# EAGLE design M1n_name (EAGLE 7.7.0)
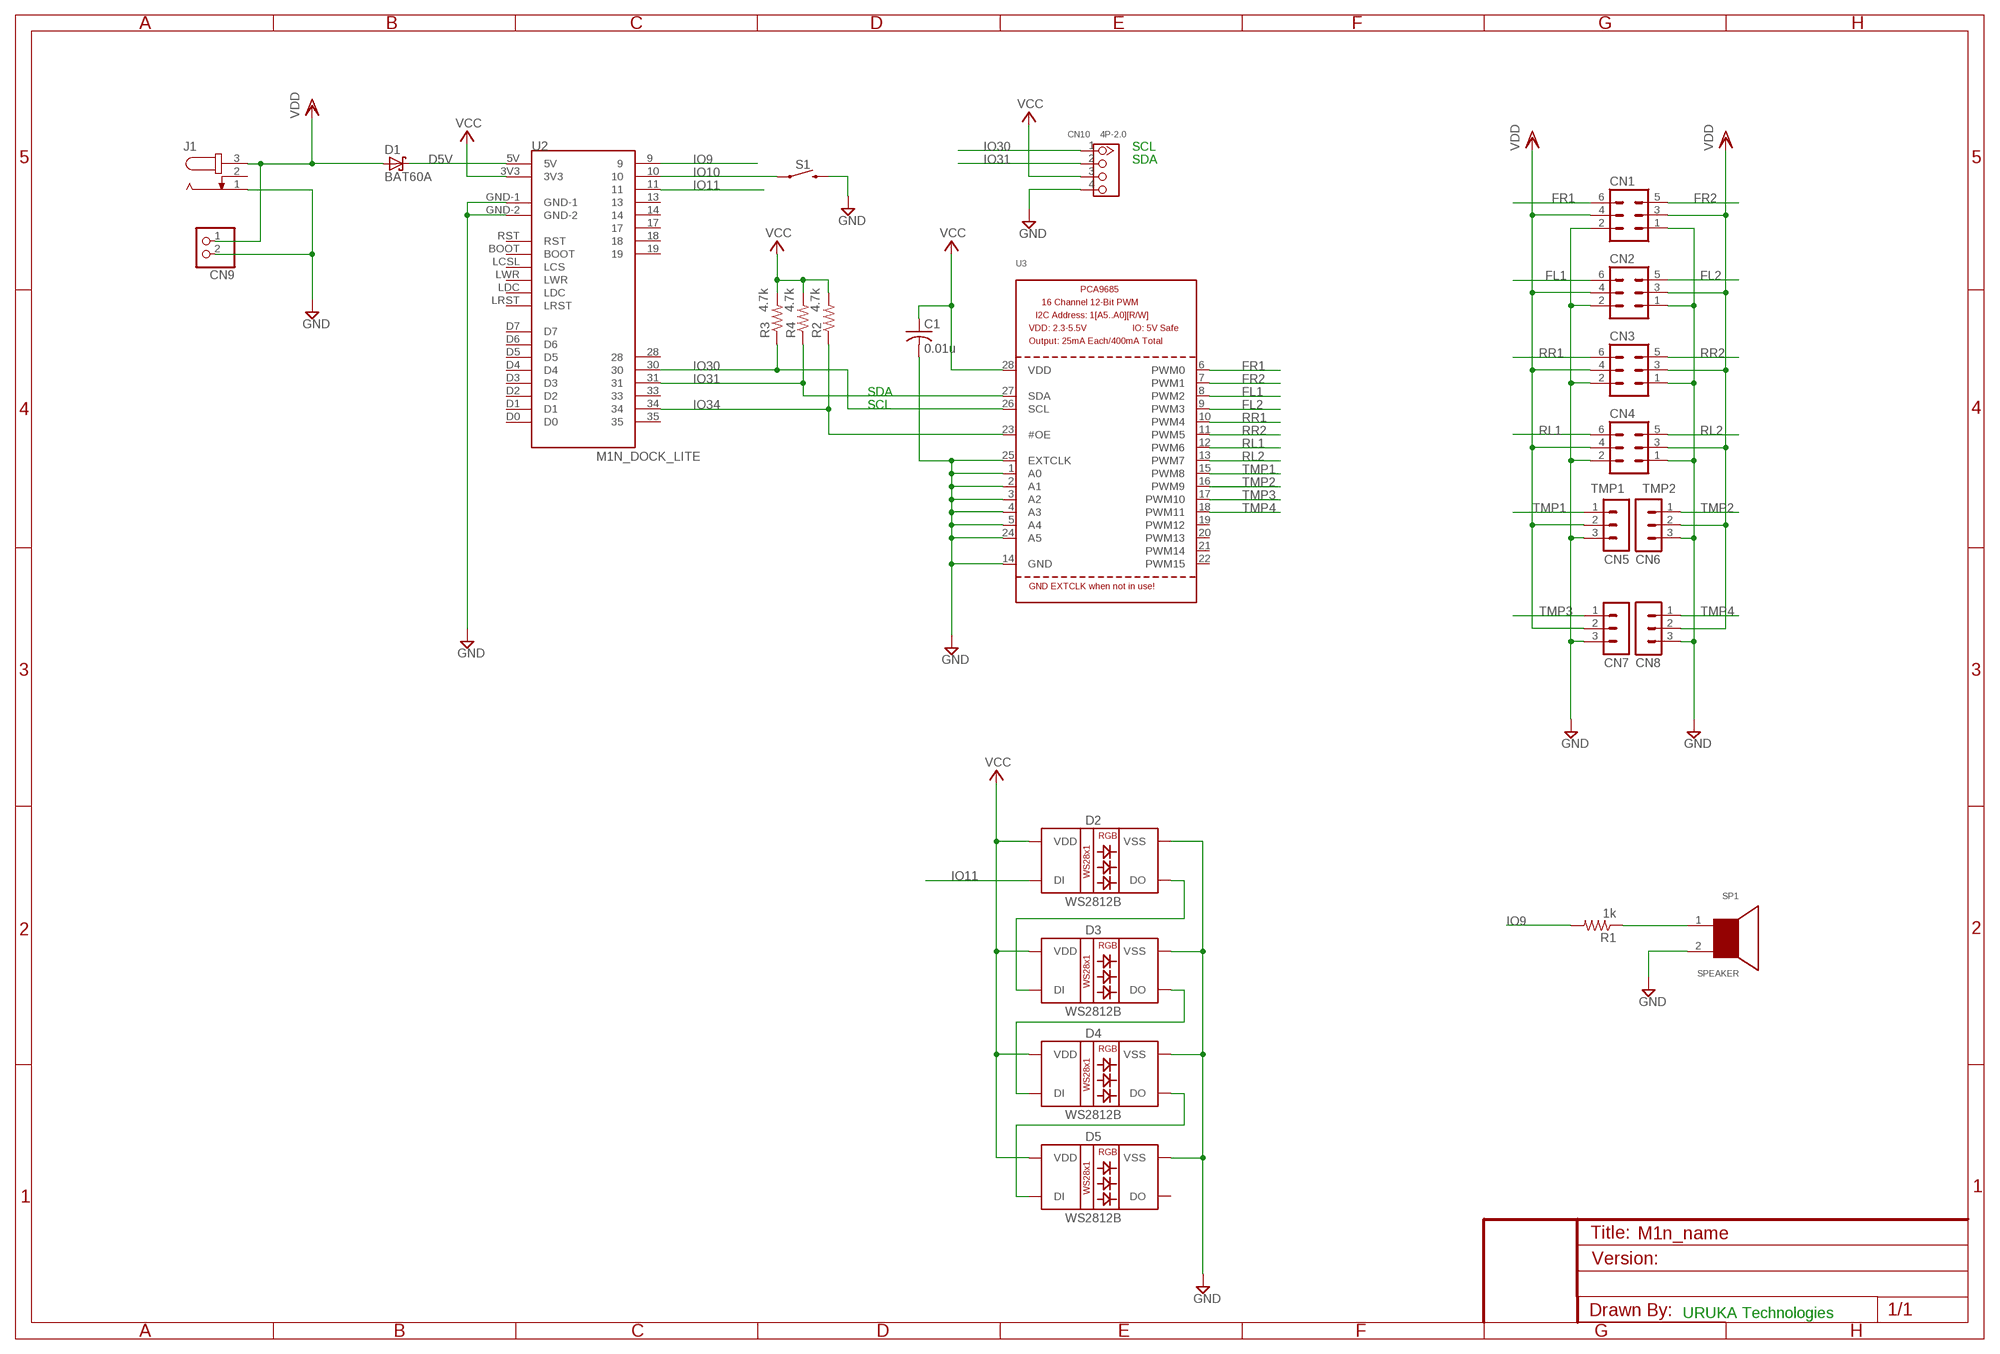
[diagram p0: schematic, sheet 1]

## Parts
C1  0.01u  C-USC0603  [C0603]
CN1  MA03-2  [MA03-2]
CN2  MA03-2  [MA03-2]
CN3  MA03-2  [MA03-2]
CN4  MA03-2  [MA03-2]
CN5  MA03-1  [MA03-1]
CN6  MA03-1  [MA03-1]
CN7  MA03-1  [MA03-1]
CN8  MA03-1  [MA03-1]
CN9  JST_2PIN-THM  [JST-PH-2-THM]
CN10  4P-2.0  GROVE-CONNECTOR-DIP(4P-2.0)  [HW4-2.0]
D1  BAT60A  [SOD323_ST]
D2  WS2812B  WS2812_2020  [WS2812_2020]
D3  WS2812B  WS2812_2020  [WS2812_2020]
D4  WS2812B  WS2812_2020  [WS2812_2020]
D5  WS2812B  WS2812_2020  [WS2812_2020]
J1  JACK-PLUG0  [SPC4077]
R1  1k  R-US_0204/5  [0204/5]
R2  4.7k  R-US_0204/5  [0204/5]
R3  4.7k  R-US_0204/5  [0204/5]
R4  4.7k  R-US_0204/5  [0204/5]
S1  MOMENTARY-SWITCH-SPST-SMD-6.0X3.5MM  [TACTILE_SWITCH_SMD_6.0X3.5MM]
SP1  SPEAKER  [SPEAKER]
U2  M1N_DOCK_LITE  [M1N_DOCK_LITE]
U3  PCA9685  [TSSOP28]

## Nets
D5V [pow]: D1.C U2.5V
FL1: CN2.6 U3.8(PWM2)
FL2: CN2.5 U3.9(PWM3)
FR1: CN1.6 U3.6(PWM0)
FR2: CN1.5 U3.7(PWM1)
GND [pow]: C1.2 CN1.1 CN1.2 CN2.1 CN2.2 CN3.1 CN3.2 CN4.1 CN4.2 CN5.3 CN6.3 CN7.3 CN8.3 CN9.2 CN10.4 D2.2(VSS) D3.2(VSS) D4.2(VSS) D5.2(VSS) J1.1 S1.2 SP1.2 U2.GND-1 U2.GND-2 U3.1(A0) U3.2(A1) U3.3(A2) U3.4(A3) U3.5(A4) U3.14(GND) U3.24(A5) U3.25(EXTCLK)
IO9: R1.2 U2.9
IO10: S1.1 U2.10
IO11: D2.3(DI) U2.11
IO30: CN10.1 R3.1 U2.30 U3.26(SCL)
IO31: CN10.2 R4.1 U2.31 U3.27(SDA)
IO34: R2.1 U2.34 U3.23(#OE)
N$3: D2.1(DO) D3.3(DI)
N$5: D3.1(DO) D4.3(DI)
N$7: D4.1(DO) D5.3(DI)
N$8: R1.1 SP1.1
RL1: CN4.6 U3.12(PWM6)
RL2: CN4.5 U3.13(PWM7)
RR1: CN3.6 U3.10(PWM4)
RR2: CN3.5 U3.11(PWM5)
TMP1: CN5.1 U3.15(PWM8)
TMP2: CN6.1 U3.16(PWM9)
TMP3: CN7.1 U3.17(PWM10)
TMP4: CN8.1 U3.18(PWM11)
VCC [pow]: C1.1 CN10.3 D2.4(VDD) D3.4(VDD) D4.4(VDD) D5.4(VDD) R2.2 R3.2 R4.2 U2.3V3 U3.28(VDD)
VDD [pow]: CN1.3 CN1.4 CN2.3 CN2.4 CN3.3 CN3.4 CN4.3 CN4.4 CN5.2 CN6.2 CN7.2 CN8.2 CN9.1 D1.A J1.3
Unconnected: D5.1(DO) J1.2 U2.13 U2.14 U2.17 U2.18 U2.19 U2.28 U2.33 U2.35 U2.BOOT U2.D0 U2.D1 U2.D2 U2.D3 U2.D4 U2.D5 U2.D6 U2.D7 U2.LCSL(LCS) U2.LDC U2.LRST U2.LWR U2.RST U3.19(PWM12) U3.20(PWM13) U3.21(PWM14) U3.22(PWM15)

## Notes on the sheet
- SCL
- SDA
- SDA
- SCL
- URUKA Technologies

## Library data of the parts
C1 = adafruit:C-US: CAPACITOR, American symbol
CN1-CN4 = suna_lib:MA03-2: PIN HEADER; OC_FARNELL: unknown; OC_NEWARK: unknown
CN5-CN8 = suna_lib:MA03-1: PIN HEADER; OC_FARNELL: unknown; OC_NEWARK: unknown
CN9 = suna_lib:JST_2PIN: JST 2-Pin Connectors of various flavors SMT-RA (S2B-PH-SM4) 4UConnector #17311 SMT (B2B-PH-SM4) THM-RA (S2B-PH) THM (B2B-PH)
CN10 = Seeed-OPL-Connector:GROVE-CONNECTOR-DIP(4P-2.0): 320110033
D1 = suna_lib:BAT60A: Schottky barrier diode Source: www.st.com, BAT60J.pdf
D2-D5 = suna_lib:WS2812_2020: WS2812 2020 SMD addressable RGB LED 2x2mm SMD LED with built-in controller IC.; PROD_ID: DIO-12503
J1 = suna_lib:JACK-PLUG: DC POWER JACK Power Jack, DC, Right Angle, Through Hole, Rated 5A at 16VDC, PC Terminals Distributor: Farnell (www.Farnell.de) Drawing: 84N1161.pdf / 84N1162.pdf Manufacturer: SPC Technology (www.spctechnology.com) Type: SPC4077 / SPC 4078; OC_FARNELL: unknown; OC_NEWARK: unknown
R1-R4 = rcl:R-US_: RESISTOR, American symbol
S1 = SparkFun-Switches:MOMENTARY-SWITCH-SPST: Momentary Switch (Pushbutton) - SPST Normally-open (NO) SPST momentary switches (buttons, pushbuttons). Variants PTH-12MM - 12mm square, through-hole Momentary Pushbutton Switch - 12mm Square <https://www.sparkfun.com/products/9190> (COM-09190) PTH-6.0MM, PTH-6.0MM-KIT - 6.0mm square, through-hole Mini Pushbutton Switch <https://www.sparkfun.com/products/97> (COM-00097) KIT package intended for soldering kit's - only one side of pads' copper is exposed. PTH-RIGHT-ANGLE-KIT - Right-angle, through-hole Right Angle Tactile Button <https://www.sparkfun.com/products/10791> - Used on SparkFun BigTime Watch Kit <https://www.sparkfun.com/products/11734> SMD-12MM - 12mm square, surface-mount Tactile Button - SMD (12mm) <https://www.sparkfun.com/products/12993> (COM-12993) Used on SparkFun PicoBoard <https://www.sparkfun.com/products/11888> SMD-4.5MM - 4.5mm Square Trackball Switch Used on SparkFun Blackberry Trackballer Breakout <https://www.sparkfun.com/products/13169> SMD-4.6MMX2.8MM - 4.60mm x 2.80mm, surface mount Used on SparkFun SAMD21 Mini Breakout <https://www.sparkfun.com/products/13664> SMD-5.2MM, SMD-5.2-REDUNDANT - 5.2mm square, surface-mount Mini Pushbutton Switch - SMD <https://www.sparkfun.com/products/8720> (COM-08720) Used on Arduino Pro Mini <https://www.sparkfun.com/products/11114> REDUNDANT package connects both switch circuits together SMD-6.0X3.5MM - 6.0 x 3.5mm, surface mount Momentary Reset Switch SMD <https://www.sparkfun.com/products/8229> (COM-08229) SMD-6.2MM-TALL - 6.2mm square, surface mount Tactile Button - SMD (6mm) <https://www.sparkfun.com/products/12992> Used on SparkFun Digital Sandbox <https://www.sparkfun.com/products/12651> SMD-RIGHT-ANGLE - Right-angle, surface mount Used on SparkFun Block for Intel® Edison - Arduino <https://www.sparkfun.com/products/13036>; PROD_ID: SWCH-14278; SF_SKU: COM-08229
SP1 = cq:SPEAKER
U2 = suna_lib:M1N_DOCK_LITE
U3 = adafruit:PCA9685: PCA9685 - 16 Channel 12-Bit I2C PWM Controller 5.0V tolerant 16 channel, 12-bit I2C PWM controller with 25mA per output (max. 400mA total) Digikey: 568-5931-1-ND

## Net classes
1 pow: width 0.61 mm
2 GND: width 0.61 mm
3 moter: width 0.762 mm, clearance 0.254 mm

## Board
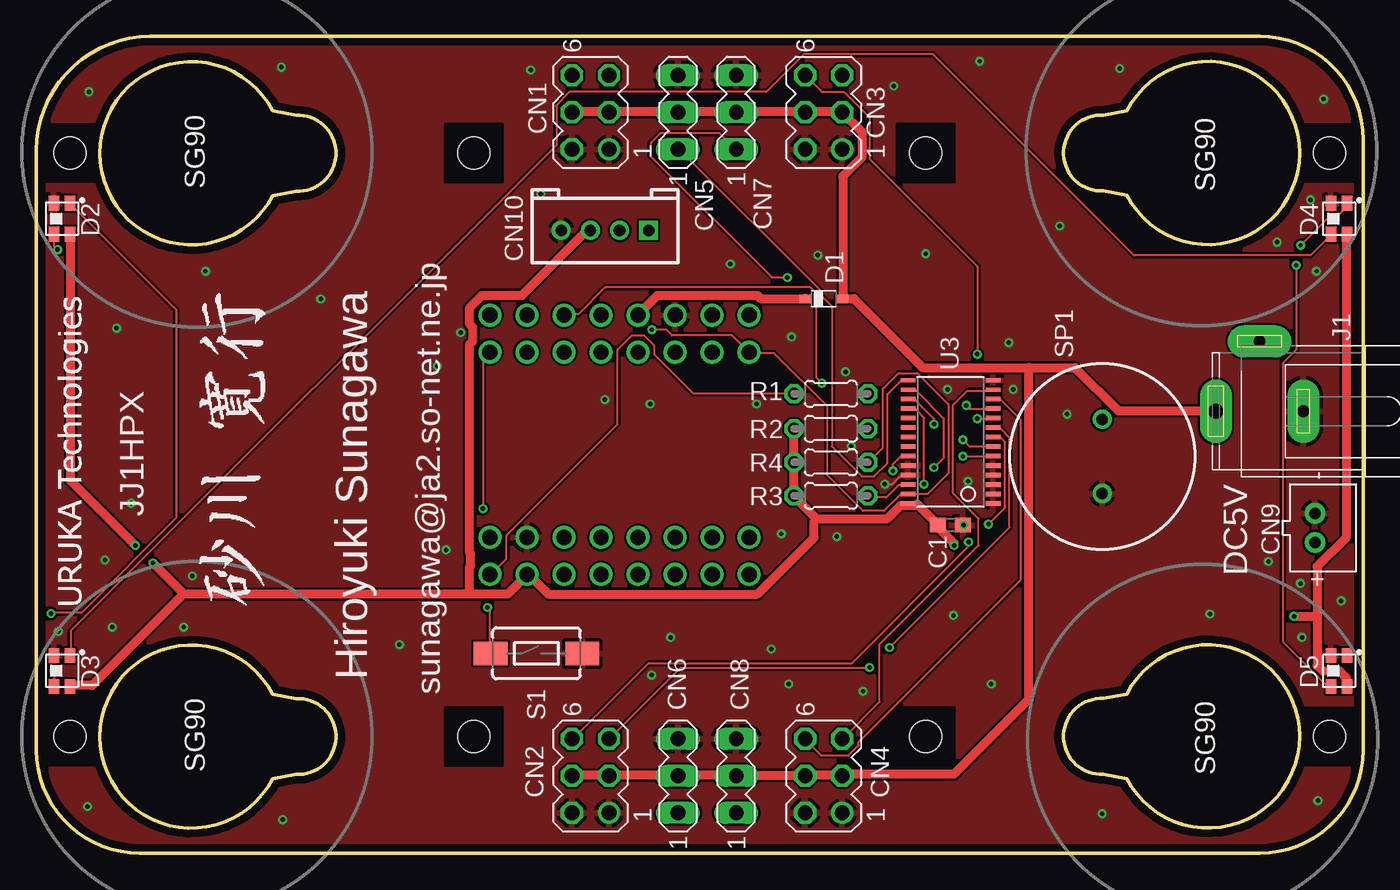
[diagram p1: board, top side]
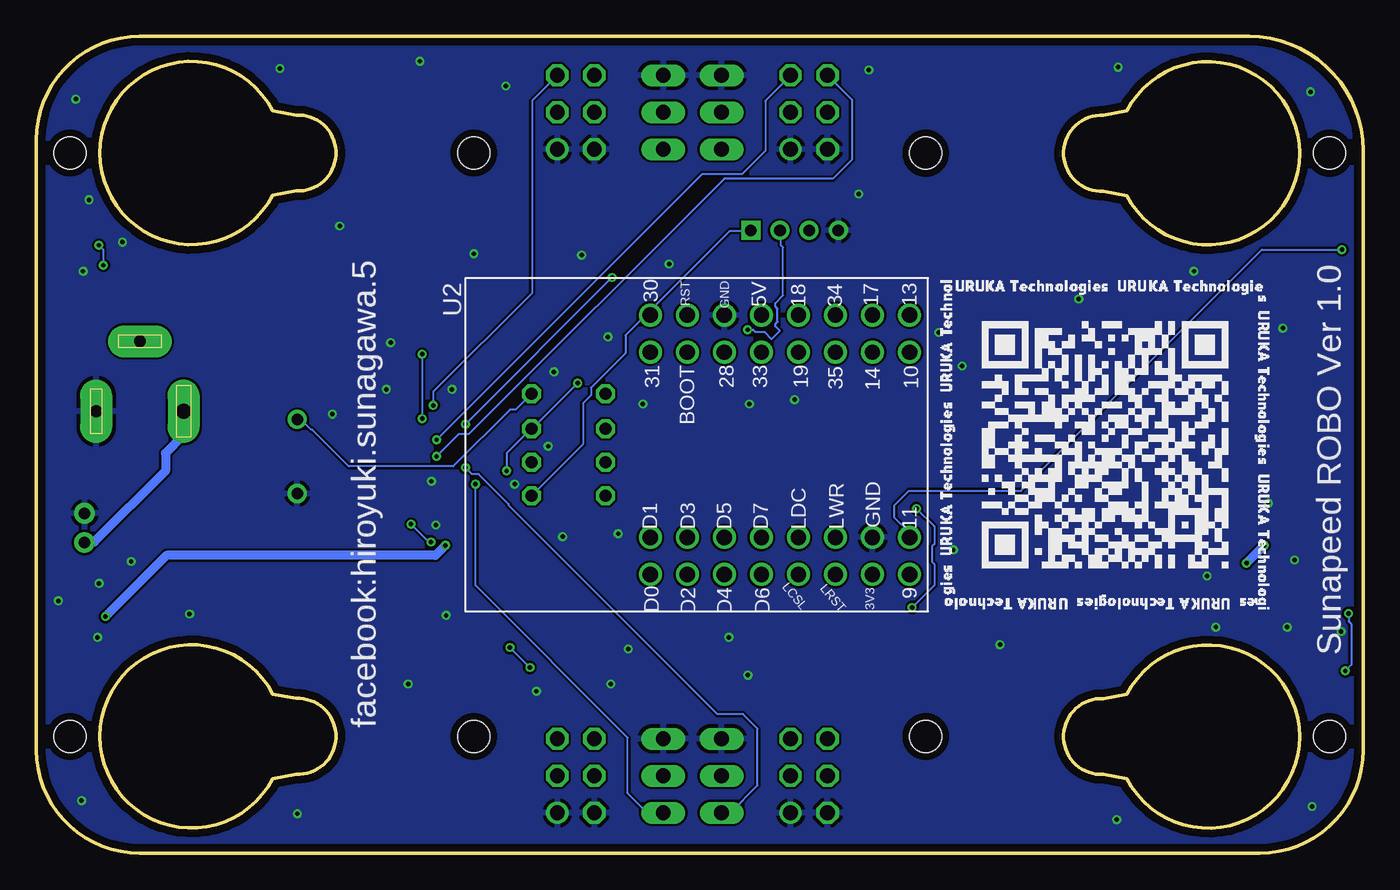
[diagram p2: board, bottom side, seen from below]

Size 91 x 56 mm. Coordinates in mm from the lower left corner, seen from the top.
Outline: 7.07,0 83.93,0 arc90 91,7.07 91,48.93 arc90 83.93,56 7.81,56 arc90 0,48.19 0,7.07 arc90 7.07,0
Copper layers (1*16): Top 0.035mm / dielectric 1.53mm / Bottom 0.035mm
Design rules "seeed_pban_5mil": minimum track width 6mil, minimum drill 12mil, track to track 6mil, track to pad 0.229mm, pad to pad 6mil, via to via 6mil, smd to smd 5mil, copper to edge 0.5mm, drill to drill 0.5mm, minimum pad ring 10mil, minimum via ring 6mil, stop-mask expansion 4mil, vias tented up to drill 25mil, thermal gap 10mil

### Footprints (pad centres in the part's own frame; a part is rotated, then mirrored left to right if it is on the bottom)
C0603 = smd 1.1 x 1: 1 -0.85,0; 2 0.85,0
MA03-2 = drill 1.016: 1 -2.54,-1.27 | drill 1.016 octagon: 2 -2.54,1.27; 3 0,-1.27; 4 0,1.27; 5 2.54,-1.27; 6 2.54,1.27
MA03-1 = drill 1.016 long: 1 -2.54,0; 2 0,0; 3 2.54,0
JST-PH-2-THM = drill 0.8 pad 1.422: 1 1,0; 2 -1,0
HW4-2.0 = drill 0.8 pad 1.27 square: 1 -3,0 | drill 0.8 pad 1.27: 2 -1,0; 3 1,0; 4 3,0
SOD323_ST = smd 0.8 x 0.6: A 1.25,0; C -1.25,0
WS2812_2020 = smd 1 x 0.7: 1 0.565,-0.9; 2 0.565,0.2; 3 -1.565,0.2; 4 -1.565,-0.9
SPC4077 = drill 0.8 pad 2.184 long: 1 -3,0; 2 0,-4.8 | drill 1 pad 2.184 long: 3 3,0
0204/5 = drill 0.813 octagon: 1 -2.54,0; 2 2.54,0
TACTILE_SWITCH_SMD_6.0X3.5MM = smd 2.3 x 1.6: 1 -3.15,0; 2 3.15,0
SPEAKER = drill 0.8: 1 -2.54,0; 2 2.54,0
M1N_DOCK_LITE = drill 1.05: 3V3 8.89,6.35; 5V -8.89,-1.27; 9 8.89,8.89; 10 -6.35,8.89; 11 6.35,8.89; 13 -8.89,8.89; 14 -6.35,6.35; 17 -8.89,6.35; 18 -8.89,1.27; 19 -6.35,1.27; 28 -6.35,-3.81; 30 -8.89,-8.89; 31 -6.35,-8.89; 33 -6.35,-1.27; 34 -8.89,3.81; 35 -6.35,3.81; BOOT -6.35,-6.35; D0 8.89,-8.89; D1 6.35,-8.89; D2 8.89,-6.35; D3 6.35,-6.35; D4 8.89,-3.81; D5 6.35,-3.81; D6 8.89,-1.27; D7 6.35,-1.27; GND-1 -8.89,-3.81; GND-2 6.35,6.35; LCSL 8.89,1.27; LDC 6.35,1.27; LRST 8.89,3.81; LWR 6.35,3.81; RST -8.89,-6.35
TSSOP28 = smd 0.305 x 0.991: 1 -4.225,-2.918; 2 -3.575,-2.918; 3 -2.925,-2.918; 4 -2.275,-2.918; 5 -1.625,-2.918; 6 -0.975,-2.918; 7 -0.325,-2.918; 8 0.325,-2.918; 9 0.975,-2.918; 10 1.625,-2.918; 11 2.275,-2.918; 12 2.925,-2.918; 13 3.575,-2.918; 14 4.225,-2.918; 15 4.225,2.918; 16 3.575,2.918; 17 2.925,2.918; 18 2.275,2.918; 19 1.625,2.918; 20 0.975,2.918; 21 0.325,2.918; 22 -0.325,2.918; 23 -0.975,2.918; 24 -1.625,2.918; 25 -2.275,2.918; 26 -2.925,2.918; 27 -3.575,2.918; 28 -4.225,2.918
SG90BASE = hole 2.2: -0.007,-0.004; -0.007,27.696

### Placement (x,y rotation side)
C1  62.7,22.5 0 top
CN1  38,50.8 90 top
CN2  38,5.3 90 top
CN3  54,50.8 90 top
CN4  54,5.3 90 top
CN5  44,50.8 90 top
CN6  44,5.3 90 top
CN7  48,50.8 90 top
CN8  48,5.3 90 top
CN9  87.7,22.3 270 top
CN10  39,42.7 180 top
D1  54,38 0 top
D2  1.4,44 90 top
D3  1.4,13 90 top
D4  89,44 90 top
D5  89,13 90 top
J1  83.9,30.3 180 top
R1  54.5,31.5 180 top
R2  54.5,29.1 180 top
R3  54.5,24.5 180 top
R4  54.5,26.8 180 top
S1  34.3,13.7 0 top
SP1  73.11,27.2 270 top
U2  40,28 270 bottom
U3  62.7,28.2 90 top
U$4  [SG90BASE]  30,8 90 top
U$5  [SG90BASE]  61,8 270 top
U$6  [SG90BASE]  61,48 270 top
U$7  [SG90BASE]  30,48 90 top
U$8  [M1N_GIT]  29.4,16.3 0 bottom
U$16  [SUNA]  16.8,16.2 90 top
U$17  [URUKA]  3.5,38.1 270 bottom

### Tracks (layer width: path | path; a pad name or v marks a point on that pad's centre or on a via)
D5V
  Top 0.61: D1.C 52.73,38.02 49.68,38.02 49.45,38.25 42.6,38.25 41.3,36.96 U2.5V
FL1  (via drill 0.3)
  Top 0.152: v65.3,22.55 66.45,23.7 66.45,28.19 66.14,28.5 65.68,28.5 U3.8 | v63.93,21.34 63.93,21.03 55.93,13.03 41.99,13.03 36.8,7.85 CN2.6
  Bottom 0.152: v65.3,22.55 64.08,21.34 v63.93,21.34
FL2  (via drill 0.3)
  Top 0.152: v58.52,14.1 66.75,22.33 66.75,28.5 66.14,29.11 65.68,29.11 U3.9 | v57.15,12.72 44.2,12.72 39.32,7.85 CN2.5
  Bottom 0.152: v57.15,12.72 v58.52,14.1
FR1  (via drill 0.3)
  Top 0.152: v63.55,27.2 65.61,27.2 U3.6
  Bottom 0.152: v63.55,27.2 62.03,28.73 61.34,28.73 43.81,46.25 36.35,46.25 35.05,47.55 35.05,51.66 CN1.6
FR2  (via drill 0.3)
  Top 0.152: v63.55,28.35 64.01,27.89 65.61,27.89 U3.7
  Bottom 0.152: v63.55,28.35 45.34,46.56 42.6,46.56 41,48.16 41,51.59 39.24,53.34 CN1.5
GND  (via drill 0.3)
  Top 0.152: v58.2,25.3 58.7,25.3 59.1,25.7 59.36,25.9 U3.25
  other vias: 5.5,36 11.6,39.9 3.5,3.2 5.2,15.5 4.7,20.1 10.7,19 10.1,15.5 16.9,2.3 3.6,52.2 16.8,53.9 33.9,53.7 34.6,45.2 27.5,33.4 19.5,38 6.5,24 39,31.1 51.8,35.4 47.6,40.4 53.6,41 29.1,35.7 42.1,30.8 28.1,20.8 51.1,21.9 63.6,22.5 54.9,21.7 50.4,14 43.5,14.8 42.2,12.2 51.6,11.6 56.7,11.1 24.9,14.3 65.5,11.6 62.9,16.3 87.9,3.6 73.1,2.7 80.5,16.4 89.5,17.3 86.8,14.8 86.7,18.5 84.5,20 70.7,30.1 66.7,35 87.8,39.9 61,41.1 58.8,52.6 64.7,54.3 88.3,51.7 74.3,53.8 70.2,43 67,31.8 62.5,31.8 63.9,25.5 1.5,15.2 85.1,41.9 87.4,44.8 55.5,33 49.4,30.8 55.9,27.9
  pour Bottom: 0.5,-0.5 91.5,-0.5 91,56.5 0,56.5
  pour Top: 0,-0.5 91,-0.5 91,56.5 0,56.5
IO9
  Top 0.152: R1.2 51.89,31.55 45.03,31.55 42.37,34.21 42.37,34.82 41.68,35.51 40.84,35.51 39.85,34.52 39.85,29.41 32.23,21.79 32.23,20.19 31.17,19.13 U2.9
IO10  (via drill 0.3)
  Top 0.152: v30.94,16.84 31.09,16.69 31.09,13.72 S1.1 | v30.63,23.62 30.63,33.83 31.09,34.29 U2.10
  Bottom 0.152: v30.94,16.84 29.41,18.36 29.41,19.81 29.57,19.96 29.57,21.03 29.41,21.18 29.41,22.4 v30.63,23.62
IO11  (via drill 0.3)
  Top 0.152: v1.45,41.38 1.22,41.6 1.22,42.37 D2.3
  Bottom 0.152: v1.45,41.38 6.93,41.38 23.47,24.84 31.17,24.84 32.16,23.85 32.16,23.01 31.17,22.02 31.17,21.72 U2.11
IO30
  Top 0.152: U3.26 59.74,25.22 59.12,25.22 58.3,24.4 57.14,24.4 R3.1 57.07,24.54
  Bottom 0.152: CN10.1 42.06,42.67 43.43,42.67 48.84,37.26 48.84,36.96 U2.30 48.92,36.88 49.23,36.88 50.6,35.51 50.6,34.29 52.96,31.93 52.96,31.39 53.49,30.86 53.49,28.04 57,24.54 R3.1
IO31  (via drill 0.3)
  Top 0.152: R4.1 57.07,26.82 58.06,27.81 58.06,31.85 59.13,32.92 60.43,32.92 62.56,30.79 62.56,26.06 61.11,24.61 59.82,24.61 U3.27 59.74,24.61 59.28,24.61 58.14,23.47 56.69,23.47 54.25,25.91 54.25,30.63 50.6,34.29 48.92,34.29 U2.31 48.84,34.37 47.7,35.51 43.59,35.51 43.2,35.89 v42.22,35.89
  Bottom 0.152: CN10.2 39.93,42.67 39.93,41.68 39.78,41.53 39.78,38.25 40.31,37.72 40.31,37.49 40.16,37.34 40.16,36.42 40.31,36.27 40.31,36.12 40.01,35.81 40.58,35.24 41.07,35.74 41.68,35.74 41.83,35.89 v42.22,35.89
IO34  (via drill 0.3)
  Top 0.152: v58.75,26.21 58.75,26.67 59.28,27.2 59.74,27.2 U3.23 | v53.87,32.23 53.49,32.61 53.49,38.41 53.11,38.79 39.01,38.79 37.19,36.96 36.2,36.96 U2.34
  Bottom 0.152: v58.75,26.21 58.75,27.43 57.07,29.11 R2.1 57,29.11 v53.87,32.23
N$3  (via drill 0.3)
  Top 0.152: v1.22,12.5 1.22,11.51 D3.3 | D2.1 2.36,44.5 9.6,37.26 9.6,23 3.1,16.5 1.06,16.5 v0.99,16.43
  Bottom 0.152: 1.29,12.57 v1.22,12.5 0.8,12.92 0.8,15.7 0.99,15.89 v0.99,16.43
N$5
  Top 0.152: D3.1 2.36,13.64 2.36,15.24 35.66,48.54 35.66,51.28 36.58,52.2 50.06,52.2 52.65,54.79 61.49,54.79 75.29,41 87.4,41 88.77,42.37 D4.3
N$7  (via drill 0.3)
  Top 0.152: v86.41,40.31 86.41,34.52 85.5,33.6 85.5,14.48 88.47,11.51 88.77,11.51 D5.3 | v86.72,41.68 88.77,43.74 89.31,43.74 89.84,44.27 89.84,44.5 D4.1
  Bottom 0.152: v86.41,40.31 86.41,41.38 v86.72,41.68
N$8
  Bottom 0.152: SP1.1 73.08,29.72 72.85,29.72 72.16,29.03 72.08,29.03 69.57,26.52 62.41,26.52 58.52,30.4 58.14,30.4 57.07,31.47 R1.1
RL1
  Top 0.152: U3.12 65.68,31.09 66.14,31.09 67.51,29.72 67.51,18.75 56.39,7.62 56.39,7.39 55.7,6.71 53.8,6.71 52.73,7.77 CN4.6
RL2
  Top 0.152: U3.13 65.61,31.7 63.86,31.7 62.87,30.71 62.87,24.69 64.62,22.94 64.62,21.11 57.84,14.33 57.84,10.36 55.32,7.85 CN4.5
RR1  (via drill 0.3)
  Top 0.152: v64.54,29.79 65.61,29.79 U3.10 | v64.54,34.21 64.54,40.23 57.15,47.62 57.15,50.44 55.4,52.2 53.87,52.2 CN3.6 | CN3.6
  Bottom 0.152: v64.54,34.21 v64.54,29.79
RR2  (via drill 0.3)
  Top 0.152: v63.78,30.71 64.01,30.48 65.61,30.48 U3.11
  Bottom 0.152: v63.78,30.71 63.78,31.62 57,38.41 57,51.59 55.24,53.34 CN3.5
TMP1
  Top 0.152: U3.15 59.74,32.38 59.28,32.38 58.37,31.47 58.37,26.75 57.45,25.83 56.62,25.83 54.56,27.89 54.56,37.49 53.8,38.25 53.8,38.56 44.04,48.31 CN5.1
TMP2  (via drill 0.3)
  Top 0.152: v61.57,26.44 62.26,27.13 62.26,29.79 60.35,31.7 59.82,31.7 U3.16
  Bottom 0.152: v61.57,26.44 61.11,25.98 60.66,25.98 58.6,23.93 58.6,23.85 44.27,9.53 42.52,9.53 41.53,8.53 41.53,4.65 43.36,2.82 43.97,2.82 CN6.1
TMP3  (via drill 0.3)
  Top 0.152: v61.57,29.41 61.57,29.79 60.27,31.09 59.82,31.09 U3.17 | v51.51,39.47 50.44,39.47 42.14,47.78 42.14,48.69 42.82,49.38 46.86,49.38 47.93,48.31 CN7.1
  Bottom 0.152: v51.51,39.47 v61.57,29.41
TMP4  (via drill 0.3)
  Top 0.152: v60.88,25.3 60.88,29.87 60.35,30.4 59.82,30.4 U3.18
  Bottom 0.152: v60.88,25.3 60.88,18.36 50.44,7.92 50.44,4.12 49.15,2.82 48.01,2.82 CN8.1
VCC  (via drill 0.3)
  Top 0.254: U3.28 59.7,23.98 59.7,23.85
  Top 0.61: 87.86,16.23 87.86,19.66 89.84,21.64 89.84,42.37 D4.4 | 87.86,16.23 87.86,12.88 88.24,12.5 89.38,12.5 89.84,12.04 89.84,11.51 D5.4 | 53.49,22.94 58.37,22.94 59.28,23.85 59.7,23.85 60.43,23.85 60.43,23.93 61.8,22.55 C1.1 61.95,22.25 62.94,21.26 v62.94,21.11 | 53.49,22.94 51.97,24.46 R3.2 51.97,24.77 51.97,26.75 R4.2 51.97,27.05 51.97,29.03 R2.2 | 10.06,17.75 3.81,11.51 2.36,11.51 D3.4 | 29.72,17.75 32.31,17.75 33.6,19.05 U2.3V3 33.91,18.97 35.13,17.75 49.45,17.75 53.34,21.64 53.34,22.71 53.49,22.94 | 29.72,17.75 10.06,17.75 | v6.78,21.11 2.36,25.53 2.36,42.37 D2.4 | v8,19.89 9.91,17.98 10.06,17.75 | v86.26,16.23 87.86,16.23 | 29.72,17.75 29.72,19.66 29.79,19.74 29.79,20.5 29.72,20.57 29.72,34.9 29.95,35.13 29.95,36.04 29.72,36.27 29.72,37.41 30.56,38.25 33.3,38.25 37.72,42.67 37.95,42.67 CN10.3
  Bottom 0.61: v8,19.89 v6.78,21.11 | v86.26,16.23 82.07,20.42 63.63,20.42 v62.94,21.11
VDD
  Top 0.61: CN2.4 36.8,5.33 39.24,5.33 CN2.3 39.55,5.33 43.74,5.33 CN6.2 44.04,5.33 47.93,5.33 CN8.2 48.31,5.33 52.43,5.33 CN4.4 52.73,5.33 55.24,5.33 CN4.3 55.55,5.41 62.94,5.41 68.05,10.52 68.05,33.3 | CN1.4 36.8,50.83 39.24,50.83 CN1.3 39.55,50.83 43.74,50.83 CN5.2 44.04,50.83 47.93,50.83 CN7.2 48.31,50.83 52.43,50.83 CN3.4 52.73,50.83 55.02,50.83 CN3.3 55.32,50.75 56.62,49.45 56.62,47.7 55.32,46.41 55.32,38.02 D1.A 55.63,38.02 56.08,38.02 60.81,33.3 68.05,33.3 | 68.05,33.3 71.25,33.3 74.22,30.33 80.85,30.33 J1.3
  Bottom 0.61: CN9.1 87.63,21.34 87.02,21.34 82.14,26.21 82.14,27.43 80.92,28.65 80.92,30.25 J1.3

### Text on the board
tPlace: JJ1HPX | DC5V | Hiroyuki Sunagawa | sunagawa@ja2.so-net.ne.jp
bPlace: Sunapeed ROBO Ver 1.0 | facebook:hiroyuki.sunagawa.5